# Altium project ArduinoPromini.PrjPcb
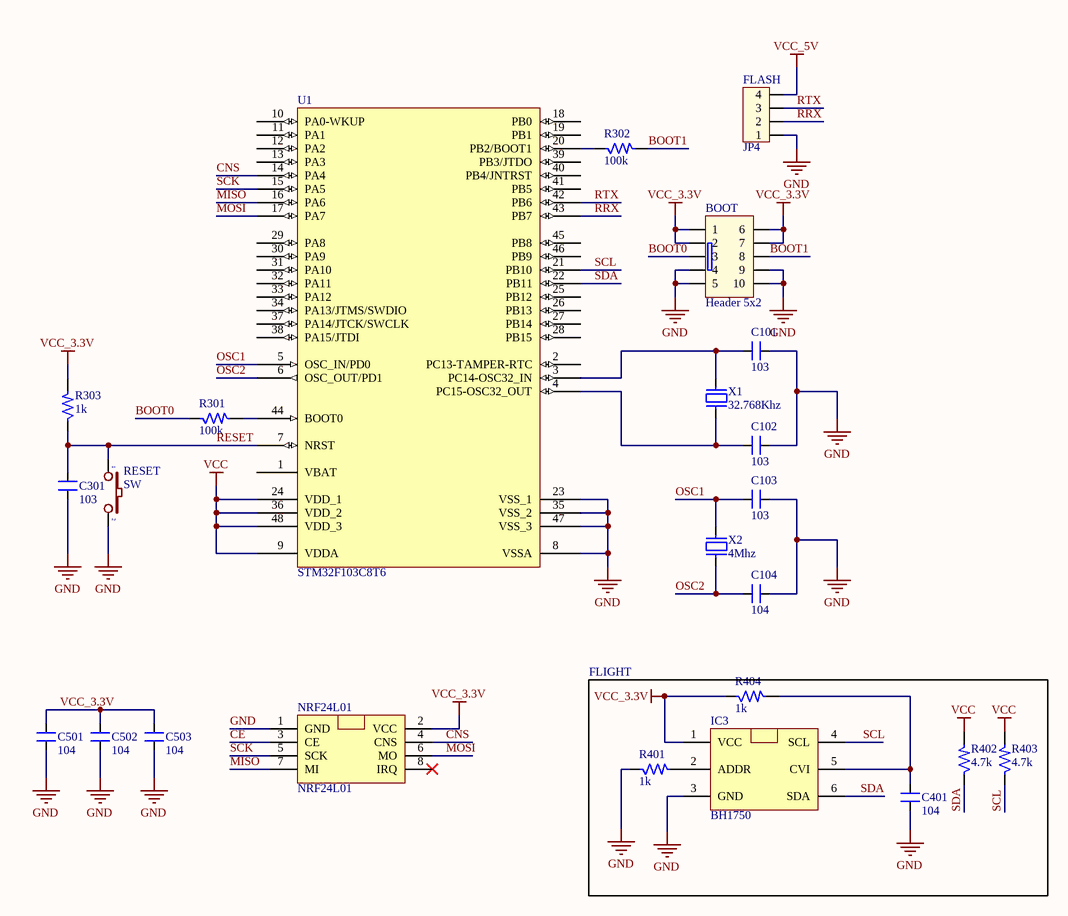
[diagram p0: ArduinoSTM32.SchDoc]
3 sheets, 91 parts. Net scope: global (net labels, ports and power ports of the same name join across sheets).
Board file: Power.PcbDoc
Sheets:
  ArduinoSTM32.SchDoc
  ArduinoPromini.SchDoc
  Power.SchDoc

## Sheet ArduinoSTM32.SchDoc
size B

### Parts
(Parts that share a designator on the sheet are numbered #1, #2 ... from top to bottom, then left to right.)
BOOT  Header 5x2  [HED2X5_cen]
C101#1  103  [SM-0805]
C102#1  103  [SM-0805]
C103  103  [SM-0805]
C104  104  [SM-0805]
C301#1  103  [SM-0805]
C401  104  [CN2]
C501  104  [SM-0805]
C502  104  [SM-0805]
C503  104  [SM-0805]
FLASH  JP4  [CON4]
IC3#1  BH1750  [BH1750]
NRF24L01#1  NRF24L01  [NRF24L01]
R301#1  100k  [SM-0805]
R302  100k  [SM-0805]
R303  1k  [SM-0805]
R401  1k  [SM-0805]
R402  4.7k  [SM-0805]
R403  4.7k  [SM-0805]
R404  1k  [SM-0805]
RESET  SW  [SW2]
U1#1  STM32F103C8T6  [TQFP48_N]
X1#1  32.768Khz  [XT32k]
X2  4Mhz  [XT2]

### Blocks framed on the sheet
FLIGHT: C401 IC3#1 R401-R404

### Nets
GND: BOOT.4 BOOT.5 BOOT.9 BOOT.10 C101#1.2 C102#1.2 C103.2 C104.2 C301#1.1 C401.1 C501.1 C502.1 C503.1 FLASH.1 IC3#1.3(GND) NRF24L01#1.1(GND) R401.1 RESET.2 U1#1.8(VSSA) U1#1.23(VSS_1) U1#1.35(VSS_2) U1#1.47(VSS_3)
VCC: R402.2 R403.2 U1#1.9(VDDA) U1#1.24(VDD_1) U1#1.36(VDD_2) U1#1.48(VDD_3)
VCC_3.3V: BOOT.1 BOOT.2 BOOT.6 BOOT.7 C501.2 C502.2 C503.2 IC3#1.1(VCC) NRF24L01#1.2(VCC) R303.2 R404.1
VCC_5V: FLASH.4
BOOT0: BOOT.3 R301#1.1
BOOT1: BOOT.8 R302.2
CE: NRF24L01#1.3(CE)
CNS: NRF24L01#1.4(CNS) U1#1.14(PA4)
MISO: NRF24L01#1.7(MI) U1#1.16(PA6)
MOSI: NRF24L01#1.6(MO) U1#1.17(PA7)
OSC1: C103.1 U1#1.5(OSC_IN/PD0) X2.2
OSC2: C104.1 U1#1.6(OSC_OUT/PD1) X2.1
RESET: C301#1.2 R303.1 RESET.1 U1#1.7(NRST)
RRX: FLASH.2 U1#1.43(PB7)
RTX: FLASH.3 U1#1.42(PB6)
SCK: NRF24L01#1.5(SCK) U1#1.15(PA5)
SCL: IC3#1.4(SCL) R403.1 U1#1.21(PB10)
SDA: IC3#1.6(SDA) R402.1 U1#1.22(PB11)
NetC101#1_1: C101#1.1 U1#1.3(PC14-OSC32_IN) X1#1.2
NetC102#1_1: C102#1.1 U1#1.4(PC15-OSC32_OUT) X1#1.1
NetC401_2: C401.2 IC3#1.5(CVI) R404.2
NetIC3#1_2: IC3#1.2(ADDR) R401.2
NetR301#1_2: R301#1.2 U1#1.44(BOOT0)
NetR302_1: R302.1 U1#1.20(PB2/BOOT1)

Not connected (* = marked no-connect by the designer): NRF24L01#1 8(IRQ)*; U1#1 1(VBAT) 2(PC13-TAMPER-RTC) 10(PA0-WKUP) 11(PA1) 12(PA2) 13(PA3) 18(PB0) 19(PB1) 25(PB12) 26(PB13) 27(PB14) 28(PB15) 29(PA8) 30(PA9) 31(PA10) 32(PA11) 33(PA12) 34(PA13/JTMS/SWDIO) 37(PA14/JTCK/SWCLK) 38(PA15/JTDI) 39(PB3/JTDO) 40(PB4/JNTRST) 41(PB5) 45(PB8) 46(PB9)

### Library data of the parts
BOOT = HED5x2: Value: Header 5x2
C101#1 C102#1 C103 C301#1 = CM: Cap SMD; Value: 103
C104 = CM: Cap SMD; Value: 103
C401 C501-C503 = CN2: Cap np 104 => 105pF; Value: 0.1uF
FLASH = Con4: Connector 4; Value: Connector 4
R301#1 R302 R303 R401-R404 = R: Resistor 1/4W; Value: R1/4W - 1K
RESET = SW2: Switch button 2 pin; Value: SW chip 2 pin
U1#1 = STM32F103C8T6: STM32 ARM-based 32-bit MCU with 64 Kbytes Flash, 48-pin LQFP, Industrial Temperature; Published: 30-May-2008; DatasheetVersion: rev6, Mar-2008; PackageVersion: Mar-2008; PackageReference: LQFP48; Publisher: Altium Limited; PackageDescription: 48-Pin Low-Profile Quad Flat Pack, 7 x 7 mm Body, 0.5 mm Pitch (LQFP48); ComponentLink1Description: Manufacturer Link; ComponentLink1URL: www.st.com/stm32; ComponentLink2Description: Datasheet; ComponentLink2URL: http://www.st.com/stonline/products/literature/ds/13587.pdf
X1#1 = XT2: Crystal For all Crystal 2pin.; Value: 4Mhz
X2 = XT2: Crystal For all Crystal 2pin.; Value: 4Mhz

## Sheet ArduinoPromini.SchDoc
size A3 portrait
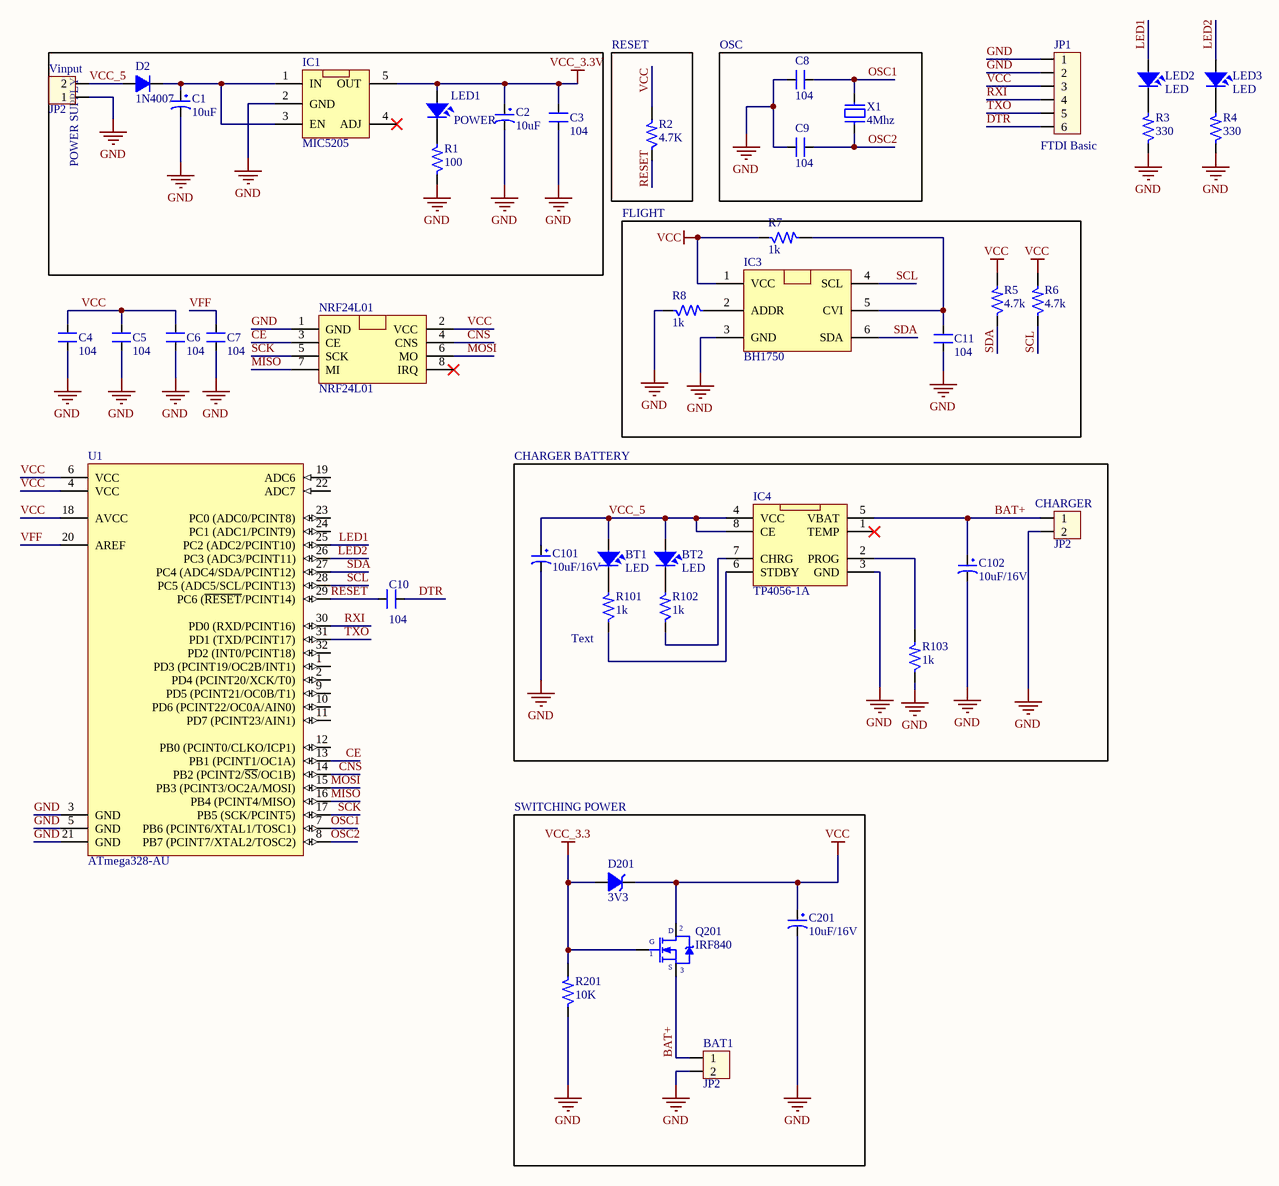
[diagram p1: ArduinoPromini.SchDoc]

### Parts
(Parts that share a designator on the sheet are numbered #1, #2 ... from top to bottom, then left to right.)
BAT1#1  JP2  [CON2]
BT1#1  LED  [LED-3]
BT2#1  LED  [LED-3]
C1  10uF  [CP1/2]
C2  10uF  [CP1/2]
C3  104  [CN2]
C4  104  [CN2]
C5  104  [CN2]
C6  104  [CN2]
C7  104  [CN2]
C8  104  [CN2]
C9  104  [CN2]
C10  104  [CN2]
C11  104  [CN2]
C101#2  10uF/16V  [CP1.5/3.4]
C102#2  10uF/16V  [CP1.5/3.4]
C201#1  10uF/16V  [CP1.5/3.4]
CHARGER#1  JP2  [CON2]
D2  1N4007  [D1A]
D201#1  3V3  [DZ0.5A]
IC1  MIC5205  [MIC5205]
IC3#2  BH1750  [BH1750]
IC4#1  TP4056-1A  [TP4056-1A]
JP1  FTDI Basic  [CON6]
LED1  POWER  [LED-3]
LED2  LED  [LED-3]
LED3  LED  [LED-3]
NRF24L01#2  NRF24L01  [NRF24L01]
Q201#1  IRF840  [QTO-220]
R1  100  [SM-1206]
R2  4.7K  [SM-1206]
R3  330  [SM-1206]
R4  330  [SM-1206]
R5  4.7k  [SM-1206]
R6  4.7k  [SM-1206]
R7  1k  [SM-1206]
R8  1k  [SM-1206]
R101#1  1k  [SM-1206]
R102#1  1k  [SM-1206]
R103#1  1k  [SM-1206]
R201#1  10K  [SM-1206]
U1#2  ATmega328-AU  [32A_N]
Vinput  JP2  [CON2]
X1#2  4Mhz  [XT2]

### Blocks framed on the sheet
POWER SUPPLY: C1-C3 D2 IC1 LED1 R1 Vinput
RESET: R2
OSC: C8 C9 X1#2
FLIGHT: C11 IC3#2 R5-R8
SWITCHING POWER: BAT1#1 C201#1 D201#1 Q201#1 R201#1

### Nets
GND: BAT1#1.2 C1.2 C2.2 C3.1 C4.1 C5.1 C6.1 C7.1 C8.2 C9.2 C11.1 C101#2.2 C102#2.2 C201#1.2 CHARGER#1.2 IC1.2(GND) IC3#2.3(GND) IC4#1.3(GND) JP1.1 JP1.2 NRF24L01#2.1(GND) R1.1 R3.1 R4.1 R8.1 R103#1.1 R201#1.1 U1#2.3(GND) U1#2.5(GND) U1#2.21(GND) Vinput.1
VCC: C4.2 C5.2 C6.2 C201#1.1 D201#1.2(K) IC3#2.1(VCC) JP1.3 NRF24L01#2.2(VCC) Q201#1.2(D) R2.2 R5.2 R6.2 R7.1 U1#2.4(VCC) U1#2.6(VCC) U1#2.18(AVCC)
VCC_3.3: D201#1.1(A) Q201#1.1(G) R201#1.2
VCC_3.3V: C2.1 C3.2 IC1.5(OUT) LED1.1
BAT+: BAT1#1.1 C102#2.1 CHARGER#1.1 IC4#1.5(VBAT) Q201#1.3(S)
CE: NRF24L01#2.3(CE) U1#2.13(PB1_(PCINT1/OC1A))
CNS: NRF24L01#2.4(CNS) U1#2.14(PB2_(PCINT2/~{SS}/OC1B))
DTR: C10.2 JP1.6
LED1: LED2.1 U1#2.25(PC2_(ADC2/PCINT10))
LED2: LED3.1 U1#2.26(PC3_(ADC3/PCINT11))
MISO: NRF24L01#2.7(MI) U1#2.16(PB4_(PCINT4/MISO))
MOSI: NRF24L01#2.6(MO) U1#2.15(PB3_(PCINT3/OC2A/MOSI))
OSC1: C8.1 U1#2.7(PB6_(PCINT6/XTAL1/TOSC1)) X1#2.2
OSC2: C9.1 U1#2.8(PB7_(PCINT7/XTAL2/TOSC2)) X1#2.1
RESET: C10.1 R2.1 U1#2.29(PC6_(~{RESET}/PCINT14))
RXI: JP1.4 U1#2.30(PD0_(RXD/PCINT16))
SCK: NRF24L01#2.5(SCK) U1#2.17(PB5_(SCK/PCINT5))
SCL: IC3#2.4(SCL) R6.1 U1#2.28(PC5_(ADC5/SCL/PCINT13))
SDA: IC3#2.6(SDA) R5.1 U1#2.27(PC4_(ADC4/SDA/PCINT12))
TXO: JP1.5 U1#2.31(PD1_(TXD/PCINT17))
VCC_5: BT1#1.1 BT2#1.1 C101#2.1 D2.1(A) IC4#1.4(VCC) IC4#1.8(CE) Vinput.2
VFF: C7.2 U1#2.20(AREF)
NetBT1#1_2: BT1#1.2 R101#1.2
NetBT2#1_2: BT2#1.2 R102#1.2
NetC1_1: C1.1 D2.2(K) IC1.1(IN) IC1.3(EN)
NetC11_2: C11.2 IC3#2.5(CVI) R7.2
NetIC3#2_2: IC3#2.2(ADDR) R8.2
NetIC4#1_2: IC4#1.2(PROG) R103#1.2
NetIC4#1_6: IC4#1.6(STDBY) R101#1.1
NetIC4#1_7: IC4#1.7(CHRG) R102#1.1
NetLED1_2: LED1.2 R1.2
NetLED2_2: LED2.2 R3.2
NetLED3_2: LED3.2 R4.2

Not connected (* = marked no-connect by the designer): IC1 4(ADJ)*; IC4#1 1(TEMP)*; NRF24L01#2 8(IRQ)*; U1#2 1(PD3_(PCINT19/OC2B/INT1)) 2(PD4_(PCINT20/XCK/T0)) 9(PD5_(PCINT21/OC0B/T1)) 10(PD6_(PCINT22/OC0A/AIN0)) 11(PD7_(PCINT23/AIN1)) 12(PB0_(PCINT0/CLKO/ICP1)) 19(ADC6) 22(ADC7) 23(PC0_(ADC0/PCINT8)) 24(PC1_(ADC1/PCINT9)) 32(PD2_(INT0/PCINT18))

### Notes on the sheet
- CHARGER BATTERY
- (near R101#1) Text
- Title
- Size:
- Date:
- A3
- Number:
- Time:
- Revision:
- Sheet
- of
- File:

### Library data of the parts
BAT1#1 CHARGER#1 Vinput = Con2: Connector 2; Value: Connector 2
BT1#1 BT2#1 LED1-LED3 = LED: LED Single colour Green and Red; Value: LED 3 ly Single Colour
C1 C2 = CP1: Cap P  0,1uF < 22uF , 16 - 50V; Value: 10uF/50V; Description 1: 10 => 220uF/6,3V/10V - 10uF => 100uF/16V; Description 2: 0,1uF => 33uF/50V - 10uF => 22uF/63V; Description 3: 0,47uF => 10uF/100V
C3-C11 = CN2: Cap np 104 => 105pF; Value: 0.1uF
C101#2 C102#2 C201#1 = CP3: Cap 100uF/35V - 470uF/16V; Value: 100uF/35V/50V; Description 1: 1000uF/6,3V - 470uF/16V - 330uF - 25V; Description 2: 220uF/35V - 100uF/50V - 63V - 4,7uF/200V; Description 3: 22uF => 33uF100V - 3,3uF => 4,7uF/250V; Description 4: 2,2uF =>3,3uF/350 - 2,2uF/400V - 1uF/450V
D2 = D1A: Diode 1A; Value: 1N4007
D201#1 = DZ: Diode Zenner; Value: 3v3
JP1 = Con6: Connector 6; Value: Connector 6
Q201#1 = IRF840: MOSFET N - CHANNEL 500V - 0.75 - 8A - TO-220; Value: IRF840
R1-R8 R101#1 R102#1 R103#1 R201#1 = R: Resistor 1/4W; Value: R1/4W - 1K
U1#2 = ATmega328-AU: 8-bit AVR Microcontroller, 32KB Flash, 1KB EEPROM, 2KB SRAM, 32-pin TQFP, Industrial Grade (-40°C to 85°C); Published: 1-Apr-2010; DatasheetVersion: revA, Jan-2010; PackageVersion: revB, Oct-2001; PackageReference: 32A; Publisher: Altium Limited; PackageDescription: 32-Lead, 7x7x1.0 mm Body, 0.8mm Lead Pitch, Thin Profile Plastic Quad Flat Package (TQFP); Supplier 1: Digi-Key; Supplier Part Number 1: ATMEGA328-AU-ND; Supplier 2: Mouser; Supplier Part Number 2: 556-ATMEGA328-AU; Code_JEDEC: MS-026-ABA; ComponentLink1Description: Manufacturer Link; ComponentLink1URL: http://www.atmel.com/products/avr/default.asp?; ComponentLink2Description: ATmega48A/48PA/88A/88PA/168A/168PA/328/328P Datasheet; ComponentLink2URL: http://www.atmel.com/dyn/resources/prod_documents/8271.pdf; ComponentLink3Description: ATmega48A/48PA/88A/88PA/168A/168PA/328/328P Summary; ComponentLink3URL: http://www.atmel.com/dyn/resources/prod_documents/8271S.pdf; ComponentLink4Description: Atmel.com Home; ComponentLink4URL: http://www.atmel.com
X1#2 = XT2: Crystal For all Crystal 2pin.; Value: 4Mhz

## Sheet Power.SchDoc
size B
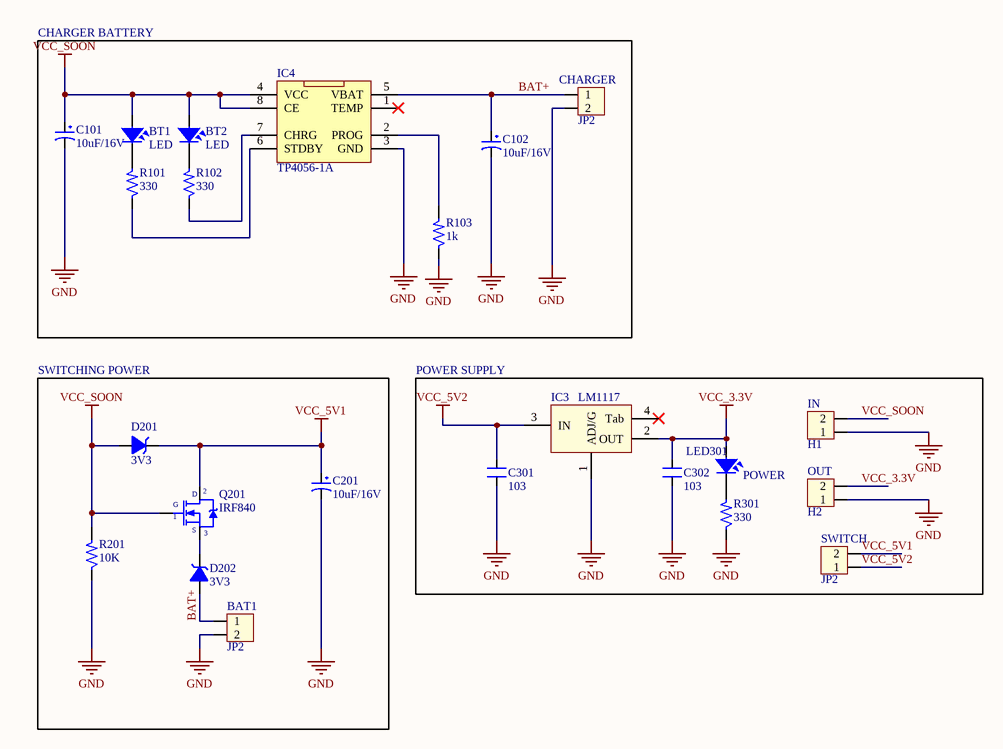
[diagram p2: Power.SchDoc]

### Parts
(Parts that share a designator on the sheet are numbered #1, #2 ... from top to bottom, then left to right.)
BAT1#2  JP2  [CON2]
BT1#2  LED  [LED0805-Blue]
BT2#2  LED  [LED0805-Blue]
C101#3  10uF/16V  [CAP-B-22UF/16V]
C102#3  10uF/16V  [CAP-B-22UF/16V]
C201#2  10uF/16V  [CAP-B-22UF/16V]
C301#2  103  [SM-0805]
C302  103  [SM-0805]
CHARGER#2  JP2  [CON2]
D201#2  3V3  [Diode1206]
D202  3V3  [Diode1206]
IC3#3  LM1117  [SOT223-4N]
IC4#2  TP4056-1A  [TP4056-1A]
IN  H1  [HED2]
LED301  POWER  [LED0805-Blue]
OUT  H2  [HED2]
Q201#2  IRF840  [QTO-220]
R101#2  330  [SM-0805]
R102#2  330  [SM-0805]
R103#2  1k  [SM-0805]
R201#2  10K  [SM-0805]
R301#2  330  [SM-0805]
SWITCH  JP2  [CON2]

### Blocks framed on the sheet
CHARGER BATTERY: BT1#2 BT2#2 C101#3 C102#3 CHARGER#2 IC4#2 R101#2 R102#2 R103#2
SWITCHING POWER: BAT1#2 C201#2 D201#2 D202 Q201#2 R201#2
POWER SUPPLY: C301#2 C302 IC3#3 IN LED301 OUT R301#2 SWITCH

### Nets
GND: BAT1#2.2 C101#3.2 C102#3.2 C201#2.2 C301#2.1 C302.1 CHARGER#2.2 IC3#3.1(ADJ/G) IC4#2.3(GND) IN.1 OUT.1 R103#2.1 R201#2.1 R301#2.1
VCC_3.3V: C302.2 IC3#3.2(OUT) LED301.1 OUT.2
VCC_5V1: C201#2.1 D201#2.2(K) Q201#2.2(D) SWITCH.2
VCC_5V2: C301#2.2 IC3#3.3(IN) SWITCH.1
VCC_SOON: BT1#2.1 BT2#2.1 C101#3.1 D201#2.1(A) IC4#2.4(VCC) IC4#2.8(CE) IN.2 Q201#2.1(G) R201#2.2
BAT+: BAT1#2.1 C102#3.1 CHARGER#2.1 D202.1(A) IC4#2.5(VBAT)
NetBT1#2_2: BT1#2.2 R101#2.2
NetBT2#2_2: BT2#2.2 R102#2.2
NetD202_2: D202.2(K) Q201#2.3(S)
NetIC4#2_2: IC4#2.2(PROG) R103#2.2
NetIC4#2_6: IC4#2.6(STDBY) R101#2.1
NetIC4#2_7: IC4#2.7(CHRG) R102#2.1
NetLED301_2: LED301.2 R301#2.2

Not connected (* = marked no-connect by the designer): IC3#3 4(Tab)*; IC4#2 1(TEMP)*

### Library data of the parts
BAT1#2 CHARGER#2 SWITCH = Con2: Connector 2; Value: Connector 2
BT1#2 BT2#2 LED301 = LED: as BT1#1 on sheet ArduinoPromini
C101#3 C102#3 C201#2 = CP3: as C101#2 on sheet ArduinoPromini
C301#2 C302 = CM: Cap SMD; Value: 103
D201#2 D202 = DZ: Diode Zenner; Value: 3v3
IC3#3 = LM1117: 3v3; Value: LM317
IN OUT = Hed2: Header 2 (Green); Value: Header 2
Q201#2 = IRF840: as Q201#1 on sheet ArduinoPromini; Value: IRF840
R101#2 R102#2 R103#2 R201#2 R301#2 = R: Resistor 1/4W; Value: R1/4W - 1K

## Nets that join several sheets
GND: ArduinoSTM32 (22 pins), ArduinoPromini (31 pins), Power (14 pins)
VCC: ArduinoSTM32 (6 pins), ArduinoPromini (16 pins)
VCC_3.3V: ArduinoSTM32 (11 pins), ArduinoPromini (C2.1 C3.2 IC1.5 LED1.1), Power (C302.2 IC3#3.2 LED301.1 OUT.2)
BAT+: ArduinoPromini (5 pins), Power (5 pins)
CE: ArduinoSTM32 (NRF24L01#1.3), ArduinoPromini (NRF24L01#2.3 U1#2.13)
CNS: ArduinoSTM32 (NRF24L01#1.4 U1#1.14), ArduinoPromini (NRF24L01#2.4 U1#2.14)
MISO: ArduinoSTM32 (NRF24L01#1.7 U1#1.16), ArduinoPromini (NRF24L01#2.7 U1#2.16)
MOSI: ArduinoSTM32 (NRF24L01#1.6 U1#1.17), ArduinoPromini (NRF24L01#2.6 U1#2.15)
OSC1: ArduinoSTM32 (C103.1 U1#1.5 X2.2), ArduinoPromini (C8.1 U1#2.7 X1#2.2)
OSC2: ArduinoSTM32 (C104.1 U1#1.6 X2.1), ArduinoPromini (C9.1 U1#2.8 X1#2.1)
RESET: ArduinoSTM32 (C301#1.2 R303.1 RESET.1 U1#1.7), ArduinoPromini (C10.1 R2.1 U1#2.29)
SCK: ArduinoSTM32 (NRF24L01#1.5 U1#1.15), ArduinoPromini (NRF24L01#2.5 U1#2.17)
SCL: ArduinoSTM32 (IC3#1.4 R403.1 U1#1.21), ArduinoPromini (IC3#2.4 R6.1 U1#2.28)
SDA: ArduinoSTM32 (IC3#1.6 R402.1 U1#1.22), ArduinoPromini (IC3#2.6 R5.1 U1#2.27)